# Altium schematic sheet Питание и сброс.SchDoc
size A4 portrait; Scale: 1:1; Разраб.: Иванов; Обозначение документа: АБВГ.123456.001 Э3; Пров.: Петров; Утв.: Сидоров; Наименование организации: ОАО "Концерн "МПО-Гидроприбор"; Перв. применение: АБВГ.123456.000; Наименование изделия 1: Плата; Наименование изделия 2: Схема электрическая; Наименование изделия 3: принципиальная; Нач. отд.: Нач. отд.; Фамилия нач. отд.: Сидоров
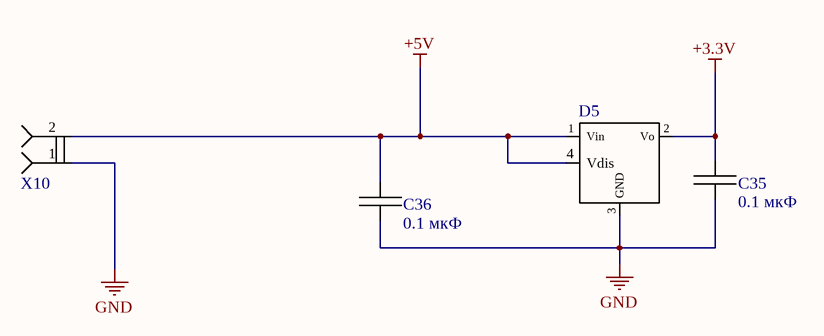
[diagram p0: Питание и сброс.SchDoc]

## Parts
C35  0.1 мкФ  [К10-2,0х1,25х1,0]
C36  0.1 мкФ  [К10-2,0х1,25х1,0]
D5  (no value)  [TO220-F-4L]
X10  (no value)  [284392-2_TE]

## Nets
+3.3V: C35.2 D5.2(Vo)
+5V: C36.2 D5.1(Vin) D5.4(Vdis) X10.2
GND: C35.1 C36.1 D5.3(GND) X10.1

## Notes on the sheet
- Title
- Size:
- Date:
- A4
- Number:
- Time:
- Revision:
- Sheet
- of
- File:

## Library data of the parts
C35 C36 = 0805-X5R-2,2мкФ-10В-10%: Manufacturer: AVX; ManufacturerPartNumber: 0805ZD225KAT2A; TKE: X5R; Power/Voltage: 10 В; Tolerance: ±10%; Category: Конденсатор; Value: 0.1 мкФ; PartNumber: 0805ZD225KAT2A
D5 = KA278R33: ManufacturerPartNumber: LM317MQDCYR; Category: Микросхема; PartNumber: KA278R33
X10 = Клемник 3.81х2 TE: Manufacturer: Tyco Electronics; ManufacturerPartNumber: 284392-2; Category: Соединитель